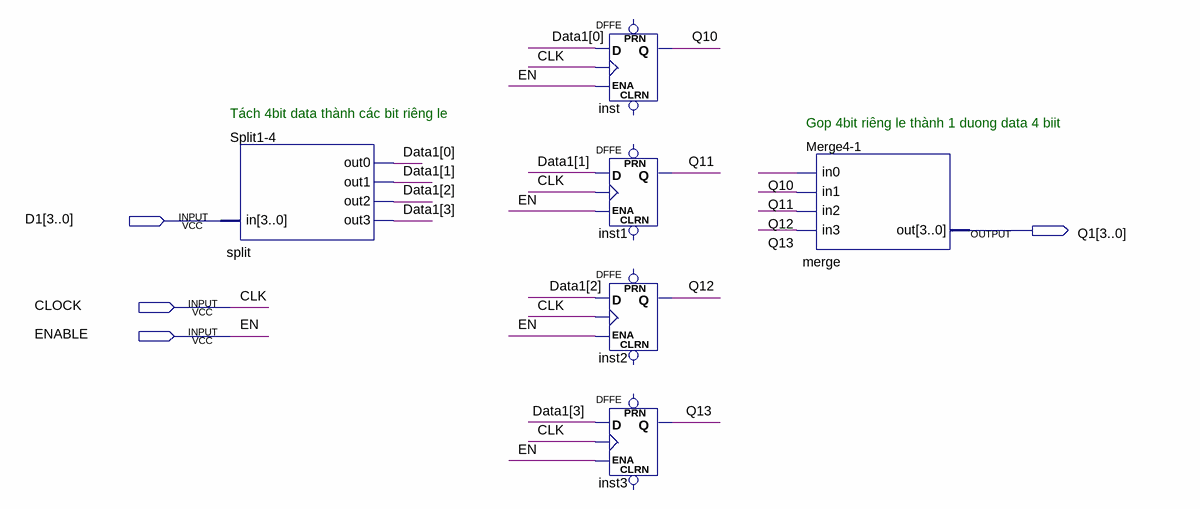
[diagram p0: schematic sheet]
// Quartus schematic Register.bdf as structural Verilog: 6 symbols, 4 pins
module Register (
  input  [3:0] D1,
  input  CLOCK,
  input  ENABLE,
  output [3:0] Q1
);

  wire [3:0] Data1;

  split \Split1-4  (.in(D1), .out3(Data1[3]), .out2(Data1[2]), .out1(Data1[1]), .out0(Data1[0]));
  DFFE inst (.D(Data1[0]), .CLK(CLOCK), .ENA(ENABLE), .Q(Q1[0]));  // open: PRN, CLRN
  DFFE inst1 (.D(Data1[1]), .CLK(CLOCK), .ENA(ENABLE), .Q(Q1[1]));  // open: PRN, CLRN
  DFFE inst2 (.D(Data1[2]), .CLK(CLOCK), .ENA(ENABLE), .Q(Q1[2]));  // open: PRN, CLRN
  DFFE inst3 (.D(Data1[3]), .CLK(CLOCK), .ENA(ENABLE), .Q(Q1[3]));  // open: PRN, CLRN
  merge \Merge4-1  (.in3(Q1[3]), .in2(Q1[2]), .in1(Q1[1]), .in0(Q1[0]), .out(Q1));

  // Other names for the same wires on the sheet: CLK = CLOCK; EN = ENABLE

  // Notes on the sheet:
  //   Tách 4bit data thành các bit riêng le
  //   Gop 4bit riêng le thành 1 duong data 4 biit
endmodule
